# EAGLE design RemSw1_0 (EAGLE 6.3)
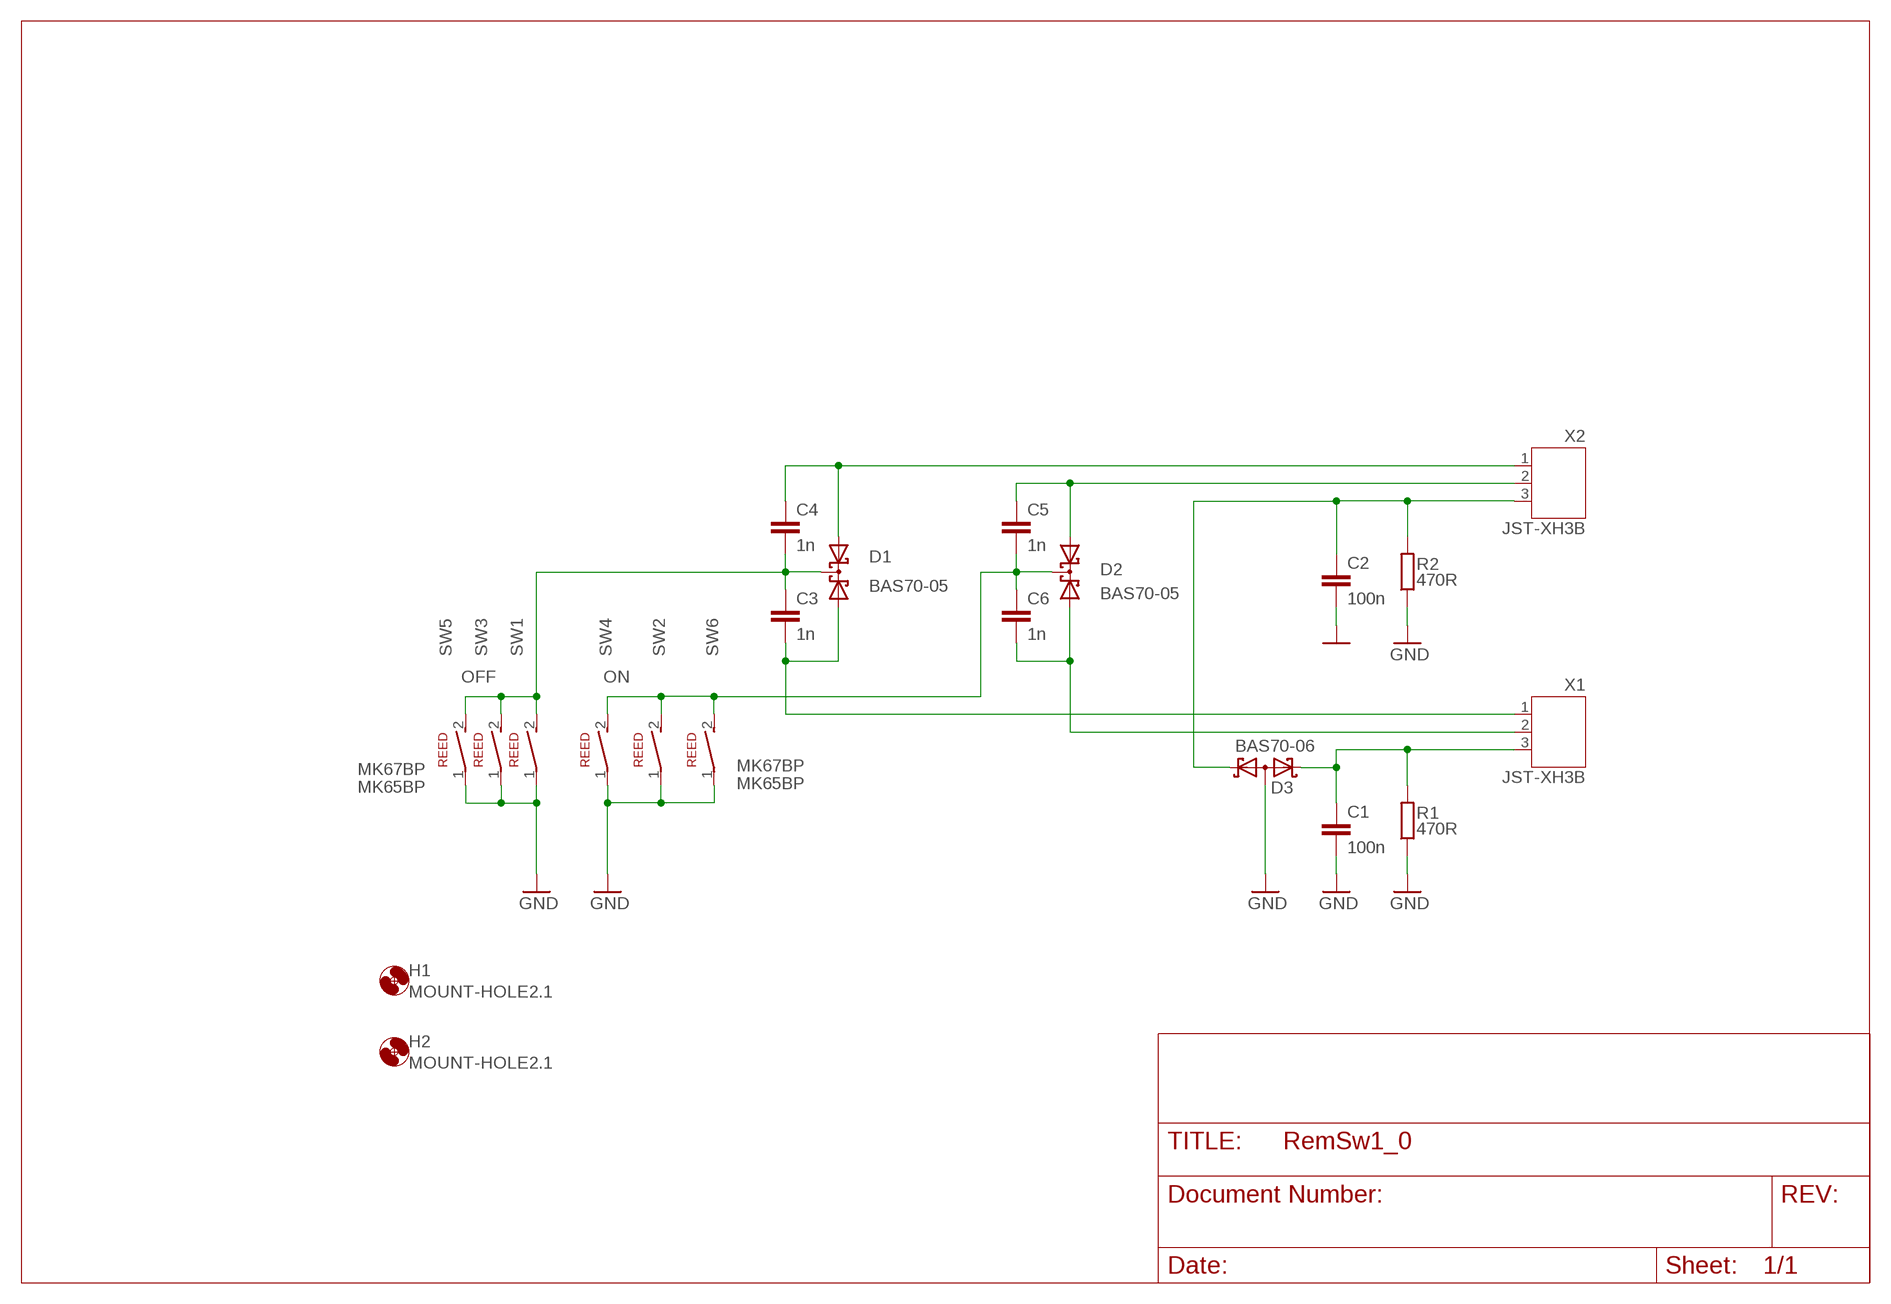
[diagram p0: schematic, sheet 1]

## Parts
C1  100n  C-EUC0805  [C0805]
C2  100n  C-EUC0805  [C0805]
C3  1n  C-EUC0805  [C0805]
C4  1n  C-EUC0805  [C0805]
C5  1n  C-EUC0805  [C0805]
C6  1n  C-EUC0805  [C0805]
D1  BAS70-05  [SOT23]
D2  BAS70-05  [SOT23]
D3  BAS70-06  [SOT23]
H1  MOUNT-HOLE2.1  [2,1]
H2  MOUNT-HOLE2.1  [2,1]
R1  470R  R-EU_R0805  [R0805]
R2  470R  R-EU_R0805  [R0805]
SW1  OFF  KSK1A66  [KSK1A66]
SW2  ON  KSK1A66  [KSK1A66]
SW3  MK67BP  [MK67-BP]
SW4  MK65BP  [MK65-BP]
SW5  MK65BP  [MK65-BP]
SW6  MK67BP  [MK67-BP]
X1  JST-XH3B  [B3B-XH]
X2  JST-XH3B  [B3B-XH]

## Nets
GND: C1.2 C2.2 D3.3(AA) R1.1 R2.1 SW1.1 SW2.1 SW3.1 SW4.1 SW5.1 SW6.1
N$1: C2.1 D3.1(K1) R2.2 X2.3
N$2: C1.1 D3.2(K2) R1.2 X1.3
N$7: C5.1 D2.1(A1) X2.2
N$8: C4.1 D1.2(A2) X2.1
N$9: C6.2 D2.2(A2) X1.2
N$10: C3.2 D1.1(A1) X1.1
OFF: C3.1 C4.2 D1.3(C) SW1.2 SW3.2 SW5.2
ON: C5.2 C6.1 D2.3(C) SW2.2 SW4.2 SW6.2

## Library data of the parts
C1-C6 = rcl:C-EU: CAPACITOR, European symbol
D1 D2 = diode:BAS70-05: Silicon Schottky Diodes General-purpose diode for high-speed switching
D3 = diode:BAS70-06: Silicon Schottky Diodes General-purpose diode for high-speed switching
H1 H2 = holes:MOUNT-HOLE: MOUNTING HOLE with drill center marker
R1 R2 = rcl:R-EU_: RESISTOR, European symbol
SW1 SW2 = switch-misc:KSK1A66
SW3-SW6 = switch-misc:MK6
X1 X2 = jst-ph-xh:JST-XH3

## Board
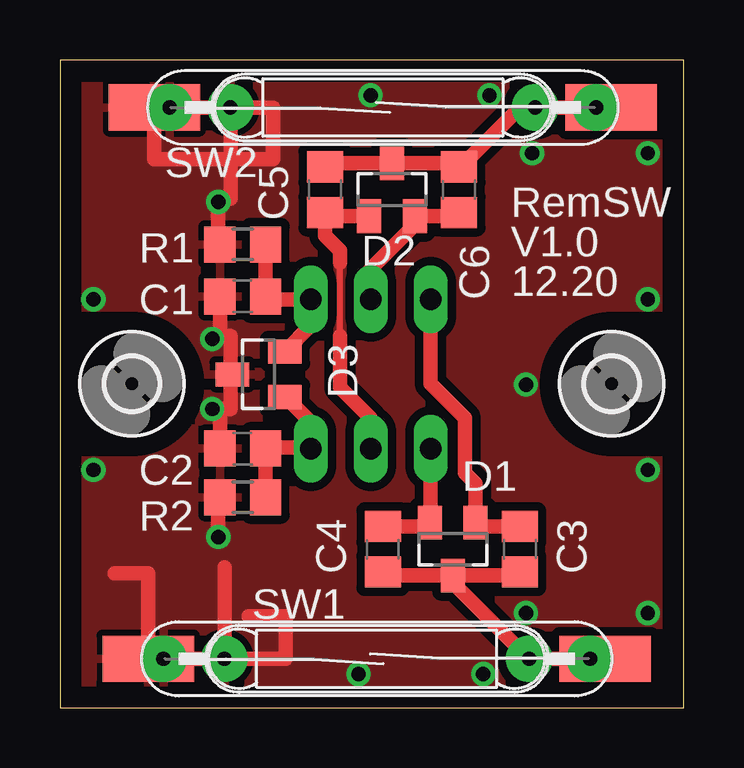
[diagram p1: board, top side]
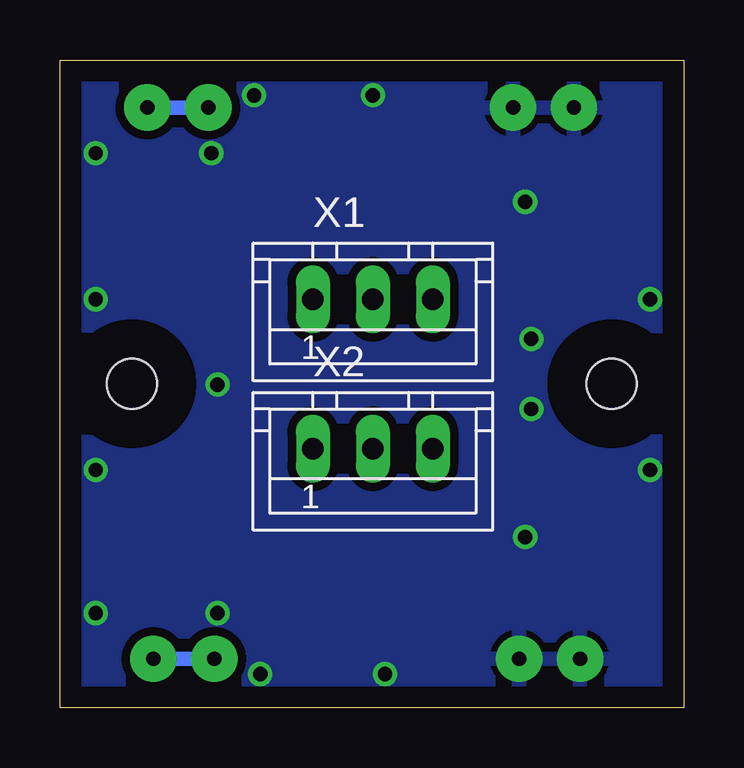
[diagram p2: board, bottom side, seen from below]

Size 26 x 27 mm. Coordinates in mm from the lower left corner, seen from the top.
Outline: 0,0 26,0 26,27 0,27 0,0
Copper layers (1*16): Top 0.035mm / dielectric 1.5mm / Bottom 0.035mm
Design rules "default *": minimum track width 10mil, minimum drill 19mil, track to track 14mil, track to pad 14mil, pad to pad 14mil, via to via 14mil, smd to smd 12mil, copper to edge 35mil, drill to drill 8mil, minimum pad ring 10mil, minimum via ring 8mil, stop-mask expansion 4mil, vias tented up to drill 0.6mm, thermal gap 10mil
tRestrict: area 20,10.5 to 26,16.5; area 0,10.5 to 6,16.5; area 0,10.5 to 3,16.5; area 23,10.5 to 26,16.5
Milling: 4 lines

### Footprints (pad centres in the part's own frame; a part is rotated, then mirrored left to right if it is on the bottom)
C0805 = smd 1.3 x 1.5: 1 -0.95,0; 2 0.95,0
SOT23 = smd 1 x 1.4: 1 -0.95,-1.1; 2 0.95,-1.1; 3 0,1.1
2,1 = hole 2.1: 0,0
R0805 = smd 1.3 x 1.5: 1 -0.95,0; 2 0.95,0
KSK1A66 = smd 3.81 x 1.93: 1 -9.525,0; 2 9.525,0
MK67-BP = drill 0.6 pad 1.93: 1 -8.89,0; 2 8.89,0
MK65-BP = drill 0.6 pad 1.93: 1 -6.35,0; 2 6.35,0
B3B-XH = drill 0.9 long: 1 -2.5,0; 2 0,0; 3 2.5,0

### Placement (x,y rotation side)
C1  7.62,17.14 180 top
C2  7.62,10.79 180 top
C3  19.18,6.6 90 top
C4  13.46,6.6 270 top
C5  11.05,21.59 90 top
C6  16.64,21.59 270 top
D1  16.38,6.6 180 top
D2  13.84,21.59 0 top
D3  8.28,13.89 90 top
H1  3,13.5 0 top
H2  23,13.5 0 top
R1  7.62,19.3 0 top
R2  7.62,8.76 0 top
SW1  13.21,2.03 0 top
SW2  13.46,25.02 0 top
SW3  13.21,2.03 0 top
SW4  13.46,25.02 0 top
SW5  13.21,2.03 0 top
SW6  13.46,25.02 0 top
X1  12.95,17.02 0 bottom
X2  12.95,10.79 0 bottom

### Tracks (layer width: path | path; a pad name or v marks a point on that pad's centre or on a via)
GND  (via drill 0.6 pad 0.81)
  Top 0.61: SW3.1 SW1.1 | SW1.1 3.68,5.59 2.29,5.59 | 7.87,3.81 9.4,3.81 9.4,2.03 SW5.1 | SW1.1 SW5.1 | SW5.1 6.86,5.84 | R2.1 6.6,8.7 v6.6,7.11 | C2.2 6.67,12.45 | 6.67,12.45 7.11,12.45 7.11,13.89 | C1.2 6.67,15.49 7.11,15.49 7.11,13.89 | 7.11,13.89 D3.3 | v6.35,12.45 6.67,12.45 | v6.6,21.08 6.6,19.3 R1.1 | 7.11,22.73 SW4.1 | 7.11,21.21 SW4.1 | SW4.1 8.89,25.02 8.89,22.86 3.94,22.86 SW2.1 SW6.1 SW4.1
  other vias: 1.4,17.02 6.35,15.37 1.4,9.91 12.95,25.53 17.91,25.53 19.68,23.11 24.51,23.11 24.51,17.02 19.43,13.46 24.51,9.91 24.51,3.94 19.43,3.94 17.65,1.4 12.45,1.4
  pour Bottom (rank 3): 0.51,0.51 0.51,26.42 25.4,26.42 25.4,0.51
  pour Top (rank 3): 0.76,0.76 0.76,25.91 25.65,25.91 25.65,0.76
N$1
  Top 0.61: D3.1 9.41,12.94 10.41,11.94 10.41,10.84 | 10.41,10.84 X2.3 | 10.41,10.84 8.61,10.84 C2.1 R2.2
N$2
  Top 0.61: R1.2 C1.1 8.7,17.02 X1.3 10.45,15.92 D3.2
N$7
  Top 0.254: 11.68,15.49 11.68,18.54
  Top 0.61: D2.1 11.2,20.49 C5.1 11.05,19.68 11.68,19.05 11.68,18.54 | X2.2 12.95,12.06 11.68,13.34 11.68,15.49
  pour Top (rank 2, no thermals): 11.56,15.62 11.56,18.67 11.81,18.67 11.81,15.62
N$8
  Top 0.61: X2.1 15.45,7.72 D1.2 15.28,7.55 C4.1
N$9
  Top 0.61: X1.2 12.95,18.29 14.73,20.07 14.73,20.43 D2.2 16.49,20.49 C6.2
N$10
  Top 0.61: C3.2 17.48,7.55 D1.1 17.33,9.34 16.89,9.78 16.89,12.06 15.45,13.5 X1.1
OFF
  Top 0.61: 23.37,2.03 SW1.2 SW3.2 SW5.2 16.38,5.21 D1.3 | D1.3 13.61,5.5 C4.2 | D1.3 19.03,5.5 C3.1
  Bottom 0.61: SW5.2 SW3.2
ON
  Top 0.61: SW2.2 SW6.2 SW4.2 19.18,25.02 16.7,22.54 C6.1 16.49,22.69 D2.3 11.2,22.69 C5.2
  Bottom 0.61: SW4.2 SW6.2

### Text on the board
tNames: RemSW | V1.0 | 12.20